# Altium schematic sheet CYAN_EVSE_Logic_board_v1.0.SchDoc
size A2
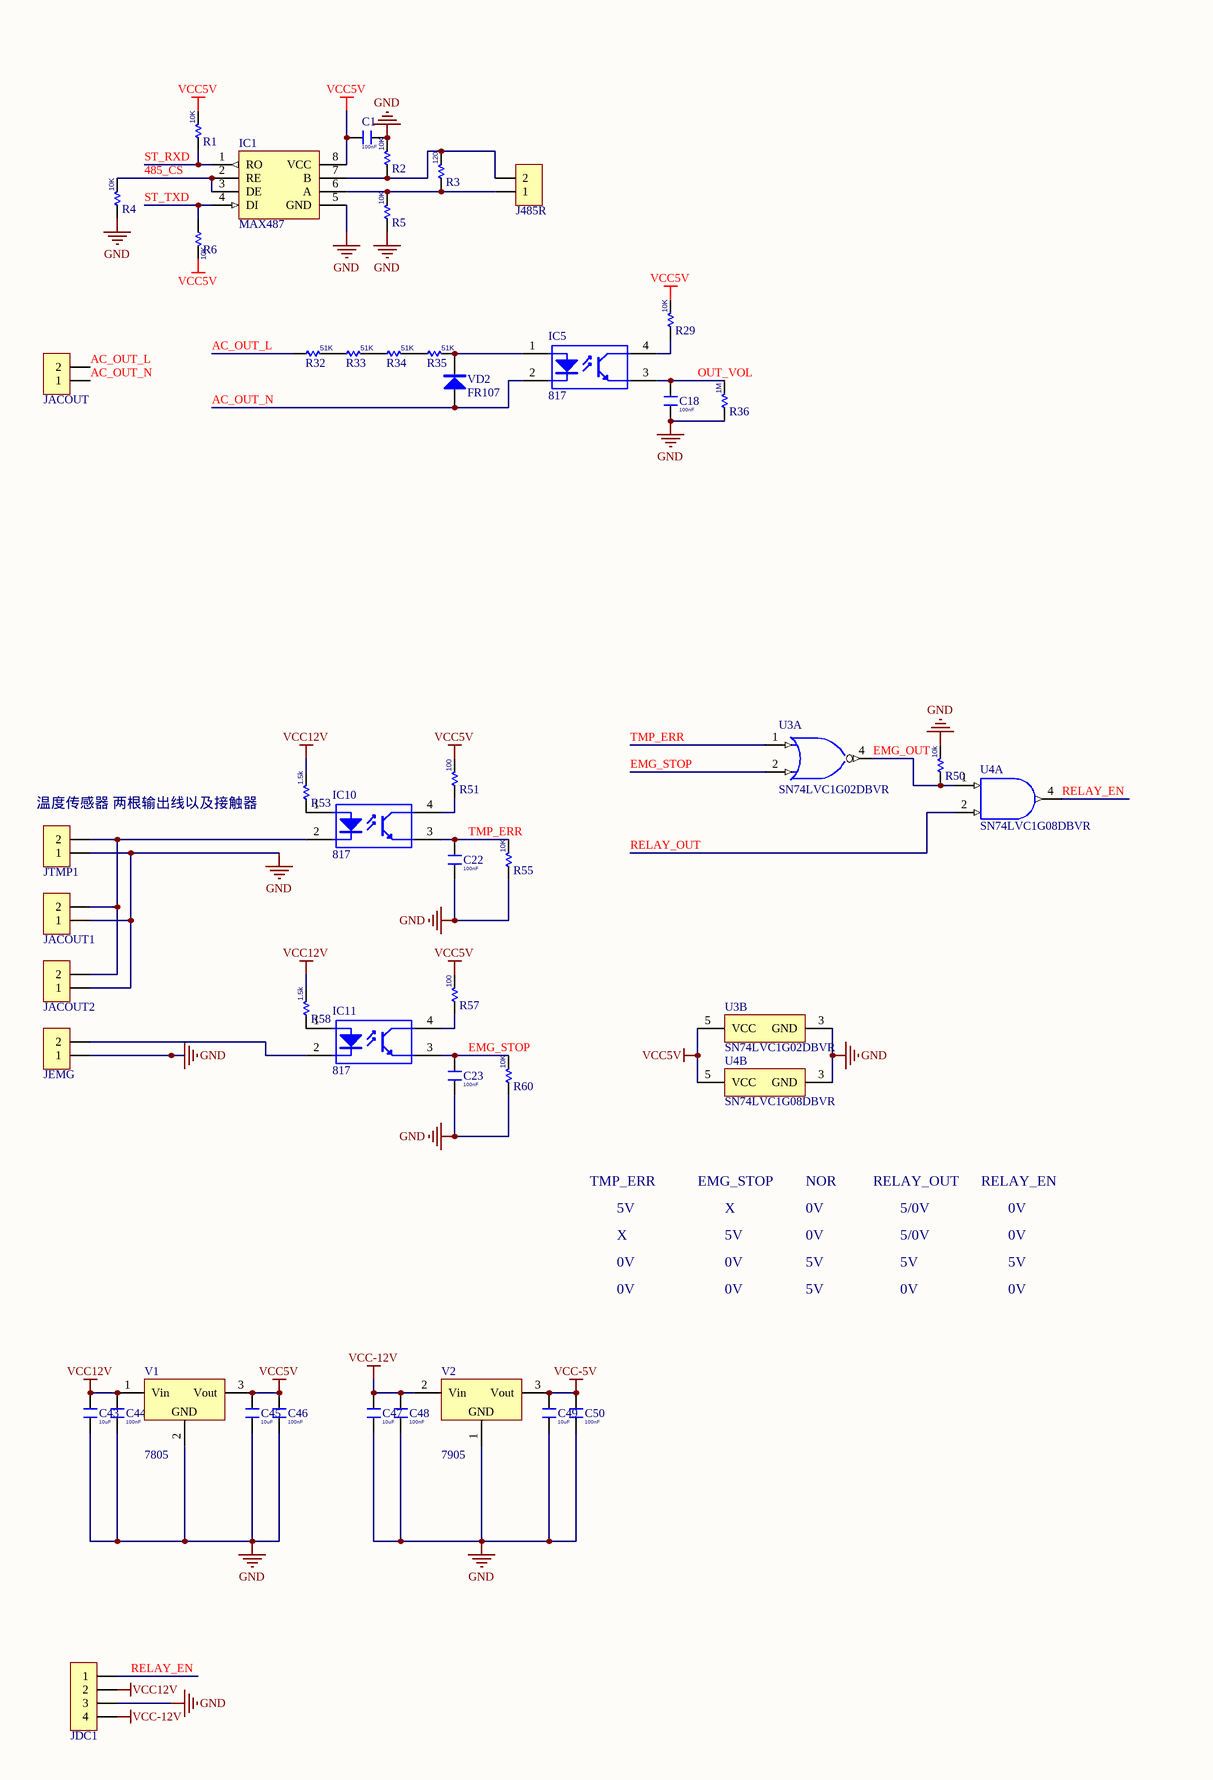
[diagram p0: CYAN_EVSE_Logic_board_v1.0.SchDoc, left]
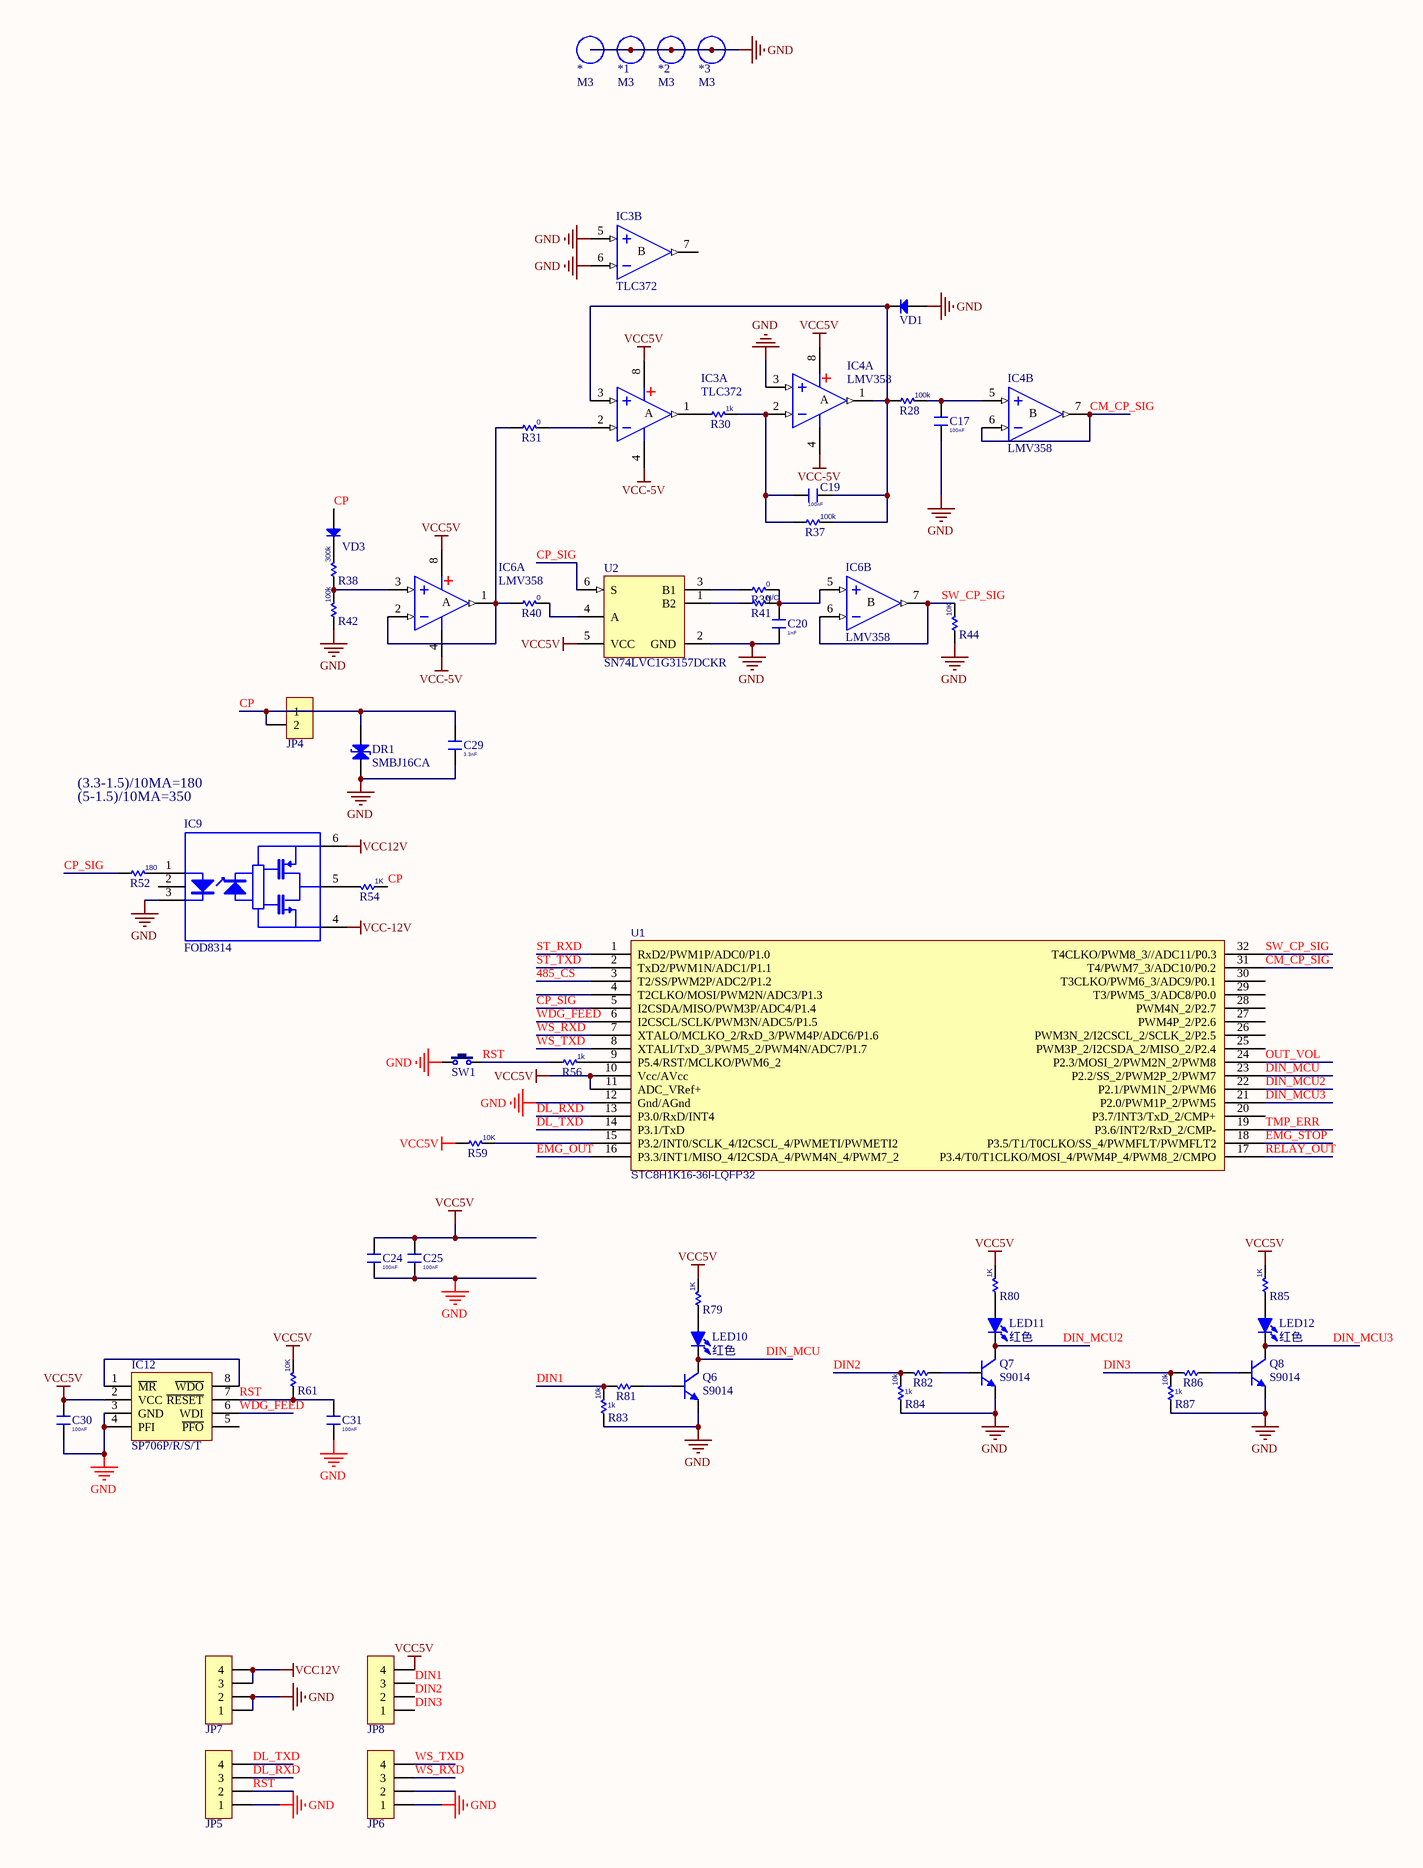
[diagram p1: CYAN_EVSE_Logic_board_v1.0.SchDoc, right]

## Parts
*  M3  [M3 125X300]
*1  M3  [M3 125X300]
*2  M3  [M3 125X300]
*3  M3  [M3 125X300]
C1  value 100nF  [C 0805]  (hidden comment: C)
C17  value 100nF  [C 0805]  (hidden comment: C)
C18  value 100nF  [C 0805]  (hidden comment: C)
C19  value 100nF  [C 0805]  (hidden comment: C)
C20  value 1nF  [C 0805]  (hidden comment: C)
C22  value 100nF  [C 0805]  (hidden comment: C)
C23  value 100nF  [C 0805]  (hidden comment: C)
C24  value 100nF  [C 0805]  (hidden comment: C)
C25  value 100nF  [C 0805]  (hidden comment: C)
C29  value 3.3nF  [C 1206]  (hidden comment: C)
C30  value 100nF  [C 0805]  (hidden comment: C)
C31  value 100nF  [C 0805]  (hidden comment: C)
C43  value 10uF  [C 0805]  (hidden comment: C)
C44  value 100nF  [C 0805]  (hidden comment: C)
C45  value 10uF  [C 0805]  (hidden comment: C)
C46  value 100nF  [C 0805]  (hidden comment: C)
C47  value 10uF  [C 0805]  (hidden comment: C)
C48  value 100nF  [C 0805]  (hidden comment: C)
C49  value 10uF  [C 0805]  (hidden comment: C)
C50  value 100nF  [C 0805]  (hidden comment: C)
DR1  SMBJ16CA  [SMB]
IC1  MAX487  [SOP8_N]
IC3  TLC372  [SOP8_L]  (parts A,B of 2)
IC4  LMV358  [SOP8_N]  (parts A,B of 2)
IC5  817  [SOP4-W2.54_M]
IC6  LMV358  [SOP8_N]  (parts A,B of 2)
IC9  FOD8314  [SOP6_L]
IC10  817  [SOP4-W2.54_M]
IC11  817  [SOP4-W2.54_M]
IC12  SP706P/R/S/T  [SOP8_N]
J485R  HDR-1X2  [MC 1,5/ 2-G-3,81]  (value not drawn)
JACOUT  HDR-1X2  [MC 1,5/ 2-G-3,81]  (value not drawn)
JACOUT1  HDR-1X2  [MC 1,5/ 2-G-3,81]  (value not drawn)
JACOUT2  HDR-1X2  [MC 1,5/ 2-G-3,81]  (value not drawn)
JDC1  HDR-1X4  [MC 1,5/ 4-G-3,81]  (value not drawn)
JEMG  HDR-1X2  [MC 1,5/ 2-G-3,81]  (value not drawn)
JP4  HDR-1X2  [MC 1,5/ 2-G-3,81]  (value not drawn)
JP5  HDR-1X4  [HDR-1X4]  (value not drawn)
JP6  HDR-1X4  [MC 1,5/ 4-G-3,81]  (value not drawn)
JP7  HDR-1X4  [MC 1,5/ 4-G-3,81]  (value not drawn)
JP8  HDR-1X4  [MC 1,5/ 4-G-3,81]  (value not drawn)
JTMP1  HDR-1X2  [MC 1,5/ 2-G-3,81]  (value not drawn)
LED10  红色  [LED 0805G]
LED11  红色  [LED 0805G]
LED12  红色  [LED 0805G]
Q6  S9014  [SOT23-3N]
Q7  S9014  [SOT23-3N]
Q8  S9014  [SOT23-3N]
R1  value 10K  [R 0805]  (hidden comment: R)
R2  value 10K  [R 0805]  (hidden comment: R)
R3  value 120  [R 1206]  (hidden comment: R)
R4  value 10K  [R 0805]  (hidden comment: R)
R5  value 10K  [R 0805]  (hidden comment: R)
R6  value 10K  [R 0805]  (hidden comment: R)
R28  value 100k  [R 0805]  (hidden comment: R)
R29  value 10K  [R 0805]  (hidden comment: R)
R30  value 1k  [R 0805]  (hidden comment: R)
R31  value 0  [R 0805]  (hidden comment: R)
R32  value 51K  [R 1206]  (hidden comment: R)
R33  value 51K  [R 1206]  (hidden comment: R)
R34  value 51K  [R 1206]  (hidden comment: R)
R35  value 51K  [R 1206]  (hidden comment: R)
R36  value 1M  [R 0805]  (hidden comment: R)
R37  value 100k  [R 0805]  (hidden comment: R)
R38  value 300k  [R 0805]  (hidden comment: R)
R39  value 0  [R 0805]  (hidden comment: R)
R40  value 0  [R 0805]  (hidden comment: R)
R41  value N/C  [R 0805]  (hidden comment: R)
R42  value 100k  [R 0805]  (hidden comment: R)
R44  value 10K  [R 0805]  (hidden comment: R)
R50  value 10k  [R 0805]  (hidden comment: R)
R51  value 100  [R 0805]  (hidden comment: R)
R52  value 180  [R 0805]  (hidden comment: R)
R53  value 1.5k  [R 0805]  (hidden comment: R)
R54  value 1K  [R 1206]  (hidden comment: R)
R55  value 10K  [R 0805]  (hidden comment: R)
R56  value 1k  [R 0805]  (hidden comment: R)
R57  value 100  [R 0805]  (hidden comment: R)
R58  value 1.5k  [R 0805]  (hidden comment: R)
R59  value 10K  [R 0805]  (hidden comment: R)
R60  value 10K  [R 0805]  (hidden comment: R)
R61  value 10K  [R 0805]  (hidden comment: R)
R79  value 1K  [R 0805]  (hidden comment: R)
R80  value 1K  [R 0805]  (hidden comment: R)
R81  value 1k  [R 0805]  (hidden comment: R)
R82  value 1k  [R 0805]  (hidden comment: R)
R83  value 10k  [R 0805]  (hidden comment: R)
R84  value 10k  [R 0805]  (hidden comment: R)
R85  value 1K  [R 0805]  (hidden comment: R)
R86  value 1k  [R 0805]  (hidden comment: R)
R87  value 10k  [R 0805]  (hidden comment: R)
SW1  NC  [TSW SMD-3*6*2.5]  (value not drawn)
U1  STC8H1K16-36I-LQFP32  [LQFP32 7X7_N]
U2  SN74LVC1G3157DCKR  [DCK0006A_N]
U3  SN74LVC1G02DBVR  [DBV0005A_N]  (parts A,B of 2)
U4  SN74LVC1G08DBVR  [DBV0005A_N]  (parts A,B of 2)
V1  7805  [TO252]
V2  7905  [TO252]
VD1  1N4148  [SOD-323]  (value not drawn)
VD2  FR107  [SOD-123]
VD3  1N4148  [SOD-323]  (value not drawn)

## Nets
GND: *.0 *1.0 *2.0 *3.0 C1.1 C17.2 C18.1 C20.1 C22.1 C23.1 C24.1 C25.1 C29.1 C30.1 C31.1 C43.1 C44.1 C45.1 C46.1 C47.1 C48.1 C49.1 C50.1 DR1.2(K) IC1.5(GND) IC3.5(IN+) IC3.6(IN-) IC4.3(IN+) IC9.3(K) IC12.3(GND) IC12.4(PFI) JACOUT1.1 JACOUT2.1 JDC1.3 JEMG.1 JP5.1 JP6.1 JP7.1 JP7.2 JTMP1.1 Q6.2(E) Q7.2(E) Q8.2(E) R2.2 R4.1 R5.1 R36.1 R42.1 R44.1 R50.2 R55.1 R60.1 R83.1 R84.1 R87.1 SW1.1 U1.12(Gnd/AGnd) U2.2(GND) U3.3(GND) U4.3(GND) V1.2(GND) V2.1(GND) VD1.1(A)
VCC5V: C1.2 C24.2 C25.2 C30.2 C45.2 C46.2 IC1.8(VCC) IC3.8(V+) IC4.8(V+) IC6.8(V+) IC12.2(VCC) JP8.4 R1.2 R6.2 R29.2 R51.2 R57.2 R59.1 R61.2 R79.2 R80.2 R85.2 U1.10(Vcc/AVcc) U1.11(ADC_VRef+) U2.5(VCC) U3.5(VCC) U4.5(VCC) V1.3(Vout)
VCC12V: C43.2 C44.2 IC9.6(VDD) JDC1.2 JP7.3 JP7.4 R53.2 R58.2 V1.1(Vin)
VCC-5V: C49.2 C50.2 IC3.4(V-) IC4.4(V-) IC6.4(V-) V2.3(Vout)
VCC-12V: C47.2 C48.2 IC9.4(VSS) JDC1.4 V2.2(Vin)
485_CS: IC1.2(RE) IC1.3(DE) R4.2 U1.3(T2/SS/PWM2P/ADC2/P1.2)
AC_OUT_L: JACOUT.2 R32.1
AC_OUT_N: IC5.2(K) JACOUT.1 VD2.1(A)
CM_CP_SIG: IC4.6(IN-) IC4.7(OUT) U1.31(T4/PWM7_3/ADC10/P0.2)
CP: C29.2 DR1.1(A) JP4.1 JP4.2 R54.1 VD3.1(A)
CP_SIG: R52.1 U1.5(I2CSDA/MISO/PWM3P/ADC4/P1.4) U2.6(S)
DIN1: JP8.3 R81.2 R83.2
DIN2: JP8.2 R82.2 R84.2
DIN3: JP8.1 R86.2 R87.2
DIN_MCU: LED10.2(K) Q6.3(C) U1.23(P2.2/SS_2/PWM2P_2/PWM7)
DIN_MCU2: LED11.2(K) Q7.3(C) U1.22(P2.1/PWM1N_2/PWM6)
DIN_MCU3: LED12.2(K) Q8.3(C) U1.21(P2.0/PWM1P_2/PWM5)
DL_RXD: JP5.3 U1.13(P3.0/RxD/INT4)
DL_TXD: JP5.4 U1.14(P3.1/TxD)
EMG_OUT: R50.1 U1.16(P3.3/INT1/MISO_4/I2CSDA_4/PWM4N_4/PWM7_2) U3.4(Y) U4.1(A)
EMG_STOP: C23.2 IC11.3(E) R60.2 U1.18(P3.5/T1/T0CLKO/SS_4/PWMFLT/PWMFLT2) U3.2(B)
OUT_VOL: C18.2 IC5.3(E) R36.2 U1.24(P2.3/MOSI_2/PWM2N_2/PWM8)
RELAY_EN: JDC1.1 U4.4(Y)
RELAY_OUT: U1.17(P3.4/T0/T1CLKO/MOSI_4/PWM4P_4/PWM8_2/CMPO) U4.2(B)
RST: C31.2 IC12.7(~{RESET}) JP5.2 R56.1 R61.1 SW1.2
ST_RXD: IC1.1(RO) R1.1 U1.1(RxD2/PWM1P/ADC0/P1.0)
ST_TXD: IC1.4(DI) R6.1 U1.2(TxD2/PWM1N/ADC1/P1.1)
SW_CP_SIG: IC6.6(IN-) IC6.7(OUT) R44.2 U1.32(T4CLKO/PWM8_3//ADC11/P0.3)
TMP_ERR: C22.2 IC10.3(E) R55.2 U1.19(P3.6/INT2/RxD_2/CMP-) U3.1(A)
WDG_FEED: IC12.6(WDI) U1.6(I2CSCL/SCLK/PWM3N/ADC5/P1.5)
WS_RXD: JP6.3 U1.7(XTALO/MCLKO_2/RxD_3/PWM4P/ADC6/P1.6)
WS_TXD: JP6.4 U1.8(XTALI/TxD_3/PWM5_2/PWM4N/ADC7/P1.7)
NetC17_1: C17.1 IC4.5(IN+) R28.2
NetC19_1: C19.1 IC3.3(IN+) IC4.1(OUT) R28.1 R37.2 VD1.2(K)
NetC19_2: C19.2 IC4.2(IN-) R30.2 R37.1
NetC20_2: C20.2 IC6.5(IN+) R39.2 R41.2
NetIC1_6: IC1.6(A) J485R.1 R3.1 R5.2
NetIC1_7: IC1.7(B) J485R.2 R2.1 R3.2
NetIC3_1: IC3.1(OUT) R30.1
NetIC3_2: IC3.2(IN-) R31.2
NetIC5_1: IC5.1(A) R35.2 VD2.2(K)
NetIC5_4: IC5.4(C) R29.1
NetIC6_1: IC6.1(OUT) IC6.2(IN-) R31.1 R40.1
NetIC6_3: IC6.3(IN+) R38.1 R42.2
NetIC9_1: IC9.1(A) R52.2
NetIC9_5: IC9.5(OUT) R54.2
NetIC10_1: IC10.1(A) R53.1
NetIC10_2: IC10.2(K) JACOUT1.2 JACOUT2.2 JTMP1.2
NetIC10_4: IC10.4(C) R51.1
NetIC11_1: IC11.1(A) R58.1
NetIC11_2: IC11.2(K) JEMG.2
NetIC11_4: IC11.4(C) R57.1
NetIC12_1: IC12.1(~{MR}) IC12.8(~{WDO})
NetLED10_1: LED10.1(A) R79.1
NetLED11_1: LED11.1(A) R80.1
NetLED12_1: LED12.1(A) R85.1
NetQ6_1: Q6.1(B) R81.1
NetQ7_1: Q7.1(B) R82.1
NetQ8_1: Q8.1(B) R86.1
NetR32_2: R32.2 R33.1
NetR33_2: R33.2 R34.1
NetR34_2: R34.2 R35.1
NetR38_2: R38.2 VD3.2(K)
NetR39_1: R39.1 U2.3(B1)
NetR40_2: R40.2 U2.4(A)
NetR41_1: R41.1 U2.1(B2)
NetR56_2: R56.2 U1.9(P5.4/RST/MCLKO/PWM6_2)
NetR59_2: R59.2 U1.15(P3.2/INT0/SCLK_4/I2CSCL_4/PWMETI/PWMETI2)

Not connected (* = marked no-connect by the designer): IC3 7(OUT); IC9 2(NC); IC12 5(~{PFO}); JP6 2; U1 4(T2CLKO/MOSI/PWM2N/ADC3/P1.3) 20(P3.7/INT3/TxD_2/CMP+) 25(PWM3P_2/I2CSDA_2/MISO_2/P2.4) 26(PWM3N_2/I2CSCL_2/SCLK_2/P2.5) 27(PWM4P_2/P2.6) 28(PWM4N_2/P2.7) 29(T3/PWM5_3/ADC8/P0.0) 30(T3CLKO/PWM6_3/ADC9/P0.1)

## Notes on the sheet
- (3.3-1.5)/10MA=180
- (near IC9) (5-1.5)/10MA=350
- (near JTMP1) 温度传感器 两根输出线以及接触器
- TMP_ERR
- EMG_STOP
- NOR
- RELAY_OUT
- RELAY_EN
- 5V
- X
- 0V
- 5/0V
- (in symbol LM358, part A) A
- (in symbol LM358, part B) B
- (in symbol TLC372, part A) A
- (in symbol TLC372, part B) B

## Library data of the parts
* *1-*3 = M3: 铜柱孔
C1 C17-C20 C22-C25 C30 C31 = C: 无极性贴片电容; Voltage: 20V
C29 C43-C50 = C: 无极性贴片电容; Voltage: 50V
DR1 = DR: 瞬态电压抑制二极管
IC1 = MAX487: RS485总线收发芯片
IC3 = TLC372: 双路电压比较,MOS下臂输出
IC4 IC6 = LM358: 双路运放
IC5 IC10 IC11 = 817: 线性光耦
IC9 = FOD8314: MOSFET/IGBT 驱动光耦，15-30v 1a
IC12 = SP706: 处理器监控芯片
J485R JACOUT JACOUT1 JACOUT2 JEMG JP4 JTMP1 = Header 2: 2P接插件
JDC1 JP5-JP8 = Header 4: 4P接插件
LED10-LED12 = LED-SMD: 贴片LED
Q6-Q8 = 9014-SMD: 低噪放大-NPN型
R1-R6 R28-R42 R44 R50-R61 R79-R87 = R: 贴片电阻
SW1 = TSW 3x6
U2 = SN74LVC1G3157DCKR: Single-Pole, Double-Throw Analog Switch, DCK0006A, LARGE T&R; Manufacturer: Texas Instruments; VCC(Min)(V): 1.65; VCC(Max)(V): 5.5; Output Type: CMOS; Logic: True; ICC @ Nom Voltage(Max)(mA): 0.01; Input Type: CMOS/TTL; Bits(#): 1; F @ Nom Voltage(Max)(Mhz): 150; Rating: Catalog; Technology Family: LVC; Voltage(Nom)(V): 1.8,2.5,3.3,5; Schmitt Trigger: No; Output Drive (IOL/IOH)(Max)(mA): 32/-32; Mux Configuration: 1：2; Switch Configuration: SPDT; tpd @ Nom Voltage(Max)(ns): 2,1.2,0.8,0.3; DatasheetVersion: SCES424H; PackageReference: DCK0006A; Supplier 1: Mouser; Supplier Part Number 1: 595-SN74LVC1G3157DCK; Supplier 2: Digi-Key; Supplier Part Number 2: 296-14909-2-ND; Supplier 3: Digi-Key; Supplier Part Number 3: 296-14909-1-ND; Supplier 4: Digi-Key; Supplier Part Number 4: 296-14909-6-ND; Generic Part Number: SN74LVC1G3157; Operating Temperature Range(C): -40 to 85; Channels(#): 1; Sub-Family: Analog Switch; 3-State Output: No; PartNumber: SN74LVC1G3157DCKR; ComponentLink1Description: Manufacturer URL; ComponentLink1URL: http://www.ti.com/; ComponentLink2Description: Datasheet; ComponentLink2URL: http://www.ti.com/lit/ds/symlink/sn74lvc1g3157.pdf
U3 = SN74LVC1G02DBVR: Single 2-Input Positive-NOR Gate, DBV0005A, LARGE T&R; Manufacturer: Texas Instruments; VCC(Min)(V): 1.65; VCC(Max)(V): 5.5; Output Type: CMOS; ICC @ Nom Voltage(Max)(mA): 0.01; Input Type: CMOS/TTL; Bits(#): 1; F @ Nom Voltage(Max)(Mhz): 150; Rating: Catalog; Technology Family: LVC; Voltage(Nom)(V): 1.8,2.5,3.3,5; Schmitt Trigger: No; Output Drive (IOL/IOH)(Max)(mA): 32/-32; tpd @ Nom Voltage(Max)(ns): 8,5.5,4.5,4; Logic: True; Gate Type: NOR; DatasheetVersion: SCES213X; PackageReference: DBV0005A; Supplier 1: Mouser; Supplier Part Number 1: 595-SN74LVC1G02DBVR; Supplier 2: Digi-Key; Supplier Part Number 2: 296-11597-2-ND; Supplier 3: Digi-Key; Supplier Part Number 3: 296-11597-1-ND; Supplier 4: Digi-Key; Supplier Part Number 4: 296-11597-6-ND; Generic Part Number: SN74LVC1G02; Operating Temperature Range(C): -40 to 125,-40 to 85; Sub-Family: NOR Gate; 3-State Output: No; PartNumber: SN74LVC1G02DBVR; ComponentLink1Description: Manufacturer URL; ComponentLink1URL: http://www.ti.com/; ComponentLink2Description: Datasheet; ComponentLink2URL: http://www.ti.com/lit/ds/symlink/sn74lvc1g02.pdf
U4 = SN74LVC1G08DBVR: Single 2-Input Positive-AND Gate, DBV0005A, LARGE T&R; Manufacturer: Texas Instruments; VCC(Min)(V): 1.65; VCC(Max)(V): 5.5; Output Type: CMOS; ICC @ Nom Voltage(Max)(mA): 0.01; Input Type: CMOS/TTL; Bits(#): 1; F @ Nom Voltage(Max)(Mhz): 150; Rating: Catalog; Technology Family: LVC; Voltage(Nom)(V): 1.8,2.5,3.3,5; Schmitt Trigger: No; Output Drive (IOL/IOH)(Max)(mA): 32/-32; tpd @ Nom Voltage(Max)(ns): 4.5,6,4,5; Logic: True; Gate Type: AND; DatasheetVersion: SCES217Y; PackageReference: DBV0005A; Supplier 1: Mouser; Supplier Part Number 1: 595-SN74LVC1G08DBVR; Supplier 2: Digi-Key; Supplier Part Number 2: 296-11601-2-ND; Supplier 3: Digi-Key; Supplier Part Number 3: 296-11601-1-ND; Supplier 4: Digi-Key; Supplier Part Number 4: 296-11601-6-ND; Generic Part Number: SN74LVC1G08; Operating Temperature Range(C): -40 to 125,-40 to 85; Sub-Family: AND Gate; 3-State Output: No; PartNumber: SN74LVC1G08DBVR; ComponentLink1Description: Manufacturer URL; ComponentLink1URL: http://www.ti.com/; ComponentLink2Description: Datasheet; ComponentLink2URL: http://www.ti.com/lit/ds/symlink/sn74lvc1g08.pdf
V1 = 78xx: 线性稳压芯片
V2 = 79xx: 线性稳压芯片
VD1 VD3 = 1N4148: 高速开关二极管
VD2 = FR107: 快恢复整流二极管